# Altium schematic sheet MCU.SchDoc
size A3; SheetNumber: 2; SheetTotal: 13
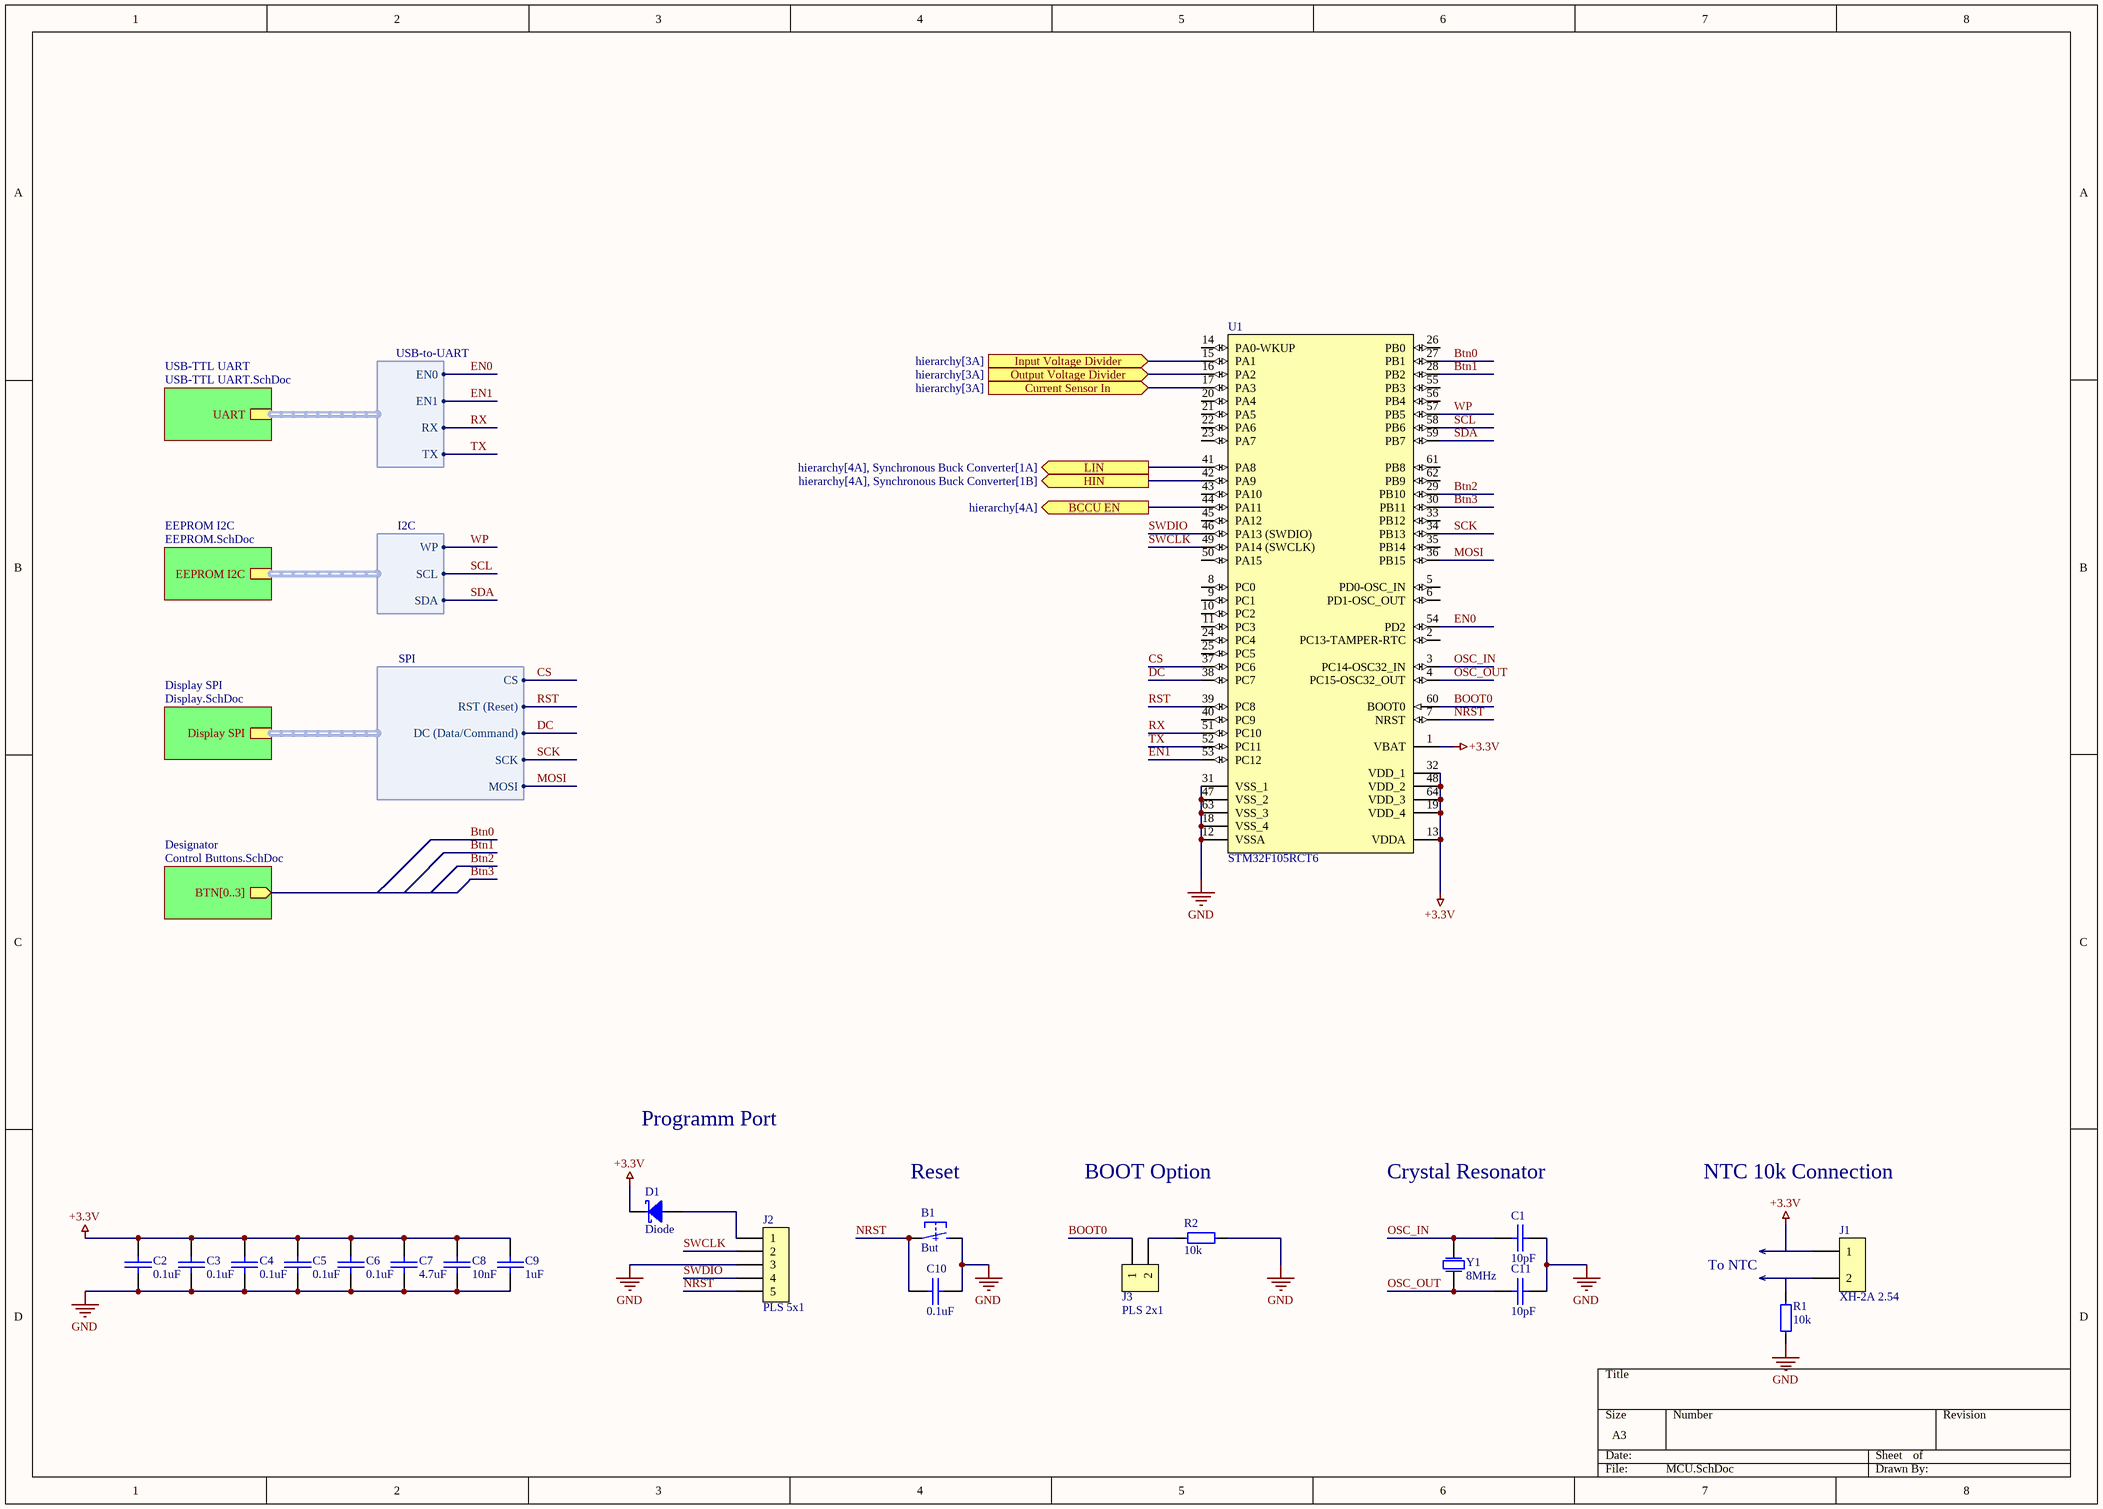
[diagram p0: MCU.SchDoc]

## Parts
B1  But  [BUTTON 6x3.5]
C1  10pF  [0805 Capicator]
C2  0.1uF  [0603 Capicator]
C3  0.1uF  [0603 Capicator]
C4  0.1uF  [0603 Capicator]
C5  0.1uF  [0603 Capicator]
C6  0.1uF  [0603 Capicator]
C7  4.7uF  [0603 Capicator]
C8  10nF  [0603 Capicator]
C9  1uF  [0603 Capicator]
C10  0.1uF  [0805 Capicator]
C11  10pF  [0805 Capicator]
D1  Diode  [sod-123]
J1  XH-2A 2.54  [CONN 1X2 (XH 2.54)]
J2  PLS 5x1  [PLS 5x1]
J3  PLS 2x1  [PLS 2X1]
R1  10k  [0805 Resistor]
R2  10k  [0805 Resistor]
U1  STM32F105RCT6  [LQFP64]
Y1  8MHz  [R38]

## Sub-sheets
Designator = Control Buttons.SchDoc: BTN[0..3] (out)
Display SPI = Display.SchDoc: Display SPI (harness SPI)
EEPROM I2C = EEPROM.SchDoc: EEPROM I2C (harness I2C)
USB-TTL UART = USB-TTL UART.SchDoc: UART (harness USB-to-UART)

## Ports
BCCU EN (out, see hierarchy[4A]), Current Sensor In (in, see hierarchy[3A]), HIN (out, see hierarchy[4A], Synchronous Buck Converter[1B]), Input Voltage Divider (in, see hierarchy[3A]), LIN (out, see hierarchy[4A], Synchronous Buck Converter[1A]), Output Voltage Divider (in, see hierarchy[3A])

## Harnesses
USB-to-UART: EN0, EN1, RX, TX
I2C: WP, SCL, SDA
SPI: CS, RST (Reset), DC (Data/Command), SCK, MOSI

## Nets
+3.3V: C2.2 C3.2 C4.2 C5.2 C6.2 C7.2 C8.2 C9.2 D1.2 J1.1 U1.1(VBAT) U1.13(VDDA) U1.19(VDD_4) U1.32(VDD_1) U1.48(VDD_2) U1.64(VDD_3)
GND: B1.2 C1.1 C2.1 C3.1 C4.1 C5.1 C6.1 C7.1 C8.1 C9.1 C10.2 C11.1 J2.3 R1.1 R2.2 U1.12(VSSA) U1.18(VSS_4) U1.31(VSS_1) U1.47(VSS_2) U1.63(VSS_3)
BCCU EN: U1.44(PA11) ; port BCCU EN
BOOT0: J3.1 U1.60(BOOT0)
Btn0: U1.27(PB1)
Btn1: U1.28(PB2)
Btn2: U1.29(PB10)
Btn3: U1.30(PB11)
CS: U1.37(PC6) ; sheet Display SPI/Display SPI.CS
Current Sensor In: U1.17(PA3) ; port Current Sensor In
DC: U1.38(PC7) ; sheet Display SPI/Display SPI.DC (Data/Command)
EN0: U1.54(PD2) ; sheet USB-TTL UART/UART.EN0
EN1: U1.53(PC12) ; sheet USB-TTL UART/UART.EN1
HIN: U1.42(PA9) ; port HIN
Input Voltage Divider: U1.15(PA1) ; port Input Voltage Divider
LIN: U1.41(PA8) ; port LIN
MOSI: U1.36(PB15) ; sheet Display SPI/Display SPI.MOSI
NRST: B1.1 C10.1 J2.5 U1.7(NRST)
OSC_IN: C1.2 U1.3(PC14-OSC32_IN) Y1.2
OSC_OUT: C11.2 U1.4(PC15-OSC32_OUT) Y1.1
Output Voltage Divider: U1.16(PA2) ; port Output Voltage Divider
RST: U1.39(PC8) ; sheet Display SPI/Display SPI.RST (Reset)
RX: U1.51(PC10) ; sheet USB-TTL UART/UART.RX
SCK: U1.34(PB13) ; sheet Display SPI/Display SPI.SCK
SCL: U1.58(PB6) ; sheet EEPROM I2C/EEPROM I2C.SCL
SDA: U1.59(PB7) ; sheet EEPROM I2C/EEPROM I2C.SDA
SWCLK: J2.2 U1.49(PA14_(SWCLK))
SWDIO: J2.4 U1.46(PA13_(SWDIO))
TX: U1.52(PC11) ; sheet USB-TTL UART/UART.TX
WP: U1.57(PB5) ; sheet EEPROM I2C/EEPROM I2C.WP
NetD1_1: D1.1 J2.1
NetJ1_2: J1.2 R1.2
NetJ3_2: J3.2 R2.1

Not connected (* = marked no-connect by the designer): U1 2(PC13-TAMPER-RTC) 5(PD0-OSC_IN) 6(PD1-OSC_OUT) 8(PC0) 9(PC1) 10(PC2) 11(PC3) 14(PA0-WKUP) 20(PA4) 21(PA5) 22(PA6) 23(PA7) 24(PC4) 25(PC5) 26(PB0) 33(PB12) 35(PB14) 40(PC9) 43(PA10) 45(PA12) 50(PA15) 55(PB3) 56(PB4) 61(PB8) 62(PB9)

## Notes on the sheet
- Programm Port
- Reset
- BOOT Option
- Crystal Resonator
- NTC 10k Connection
- (near R1) To NTC

## Library data of the parts
B1 = Button 2 Conn: Button 2 Conn SMD; Part Number: L-KLS7-TS3608-5.0-180; Manufacturer: KLS electronic co ltd; Type: Button; ComponentLink1Description: Chip&Dip; ComponentLink1URL: https://www.chipdip.ru/product/kls7-ts3608-5.0-180-td-02xa
C1 C11 = Cap 10pF (0805): 10pF NP0 50V 5% 0805; Manufacturer: Murata Manufacturing; Part Number: GRM2165C1H100JZ01D; Type: Capacitor; ComponentLink1Description: Chip&Dip; ComponentLink1URL: https://www.chipdip.ru/product/grm2165c1h100j
C2-C6 = Cap 0.1uF (0603): 0.1uF X7R 16V 10% 0603; Manufacturer: Murata Manufacturing; Part Number: GRM188R71C104KA01D; Type: Capacitor; ComponentLink1Description: Chip&Dip; ComponentLink1URL: https://www.chipdip.ru/product/grm188r71c104ka01d
C7 = Cap 4.7uF (0603): 4.7uF X5R 25V 10% 0603; Manufacturer: Murata Manufacturing; Part Number: GRM188R61E475KE11D; Type: Capacitor; ComponentLink1Description: Chip&Dip; ComponentLink1URL: https://www.chipdip.ru/product0/9000348448
C8 = Cap 10nF (0603): X7R 10nF 100V 10% 0603; Manufacturer: Murata Manufacturing; Part Number: GRM188R72A103KA01D; Type: Capacitor; ComponentLink1Description: Chip&Dip; ComponentLink1URL: https://www.chipdip.ru/product/grm188r72a103ka01d
C9 = Cap 1uF (0603): 1uF X5R 25V 10% 0603; Manufacturer: Murata Manufacturing; Part Number: GRM188R61E105KAADD; Type: Capacitor; ComponentLink1Description: Chip&Dip; ComponentLink1URL: https://www.chipdip.ru/product/grm188r61e105k
C10 = Cap 0.1uF (0805): 0.1uF X7R 25V 10% 0805; Manufacturer: Murata Manufacturing; Part Number: GRM21BR71E104KA01L; Type: Capacitor; ComponentLink1Description: Chip&Dip; ComponentLink1URL: https://www.chipdip.ru/product/grm21br71e104ka01l
D1 = Diode Schottky (SOD-123): 0.5 A, Low Forward Voltage less than 385 mV, 400 mW Power Dissipation Package; Part Number: MBR0520L; Manufacturer: ON Semiconductor; Type: Diode; ComponentLink1Description: DataSheet; ComponentLink1URL: http://www.farnell.com/datasheets/1875336.pdf; ComponentLink2Description: Chip&Dip; ComponentLink2URL: https://www.chipdip.ru/product/mbr0520l
J1 = Connector XH-2A 2.54: Connector on the board straight 2pin 2.54mm; Type: Connector; ComponentLink1Description: Buy; ComponentLink1URL: https://radioremont.com/product/razem-xh-2a-2-54mm-k148-3/
J2 = Conn 5 (PLS): Header, 5-Pin
J3 = Conn 2 (PLS)
R1 R2 = Res 10k (0805): 0.125W 0805 10k, 1%; Part Number: RC0805FR-0710KL; Manufacturer: Taiwan; Type: Resistor; ComponentLink1Description: Chip&Dip; ComponentLink1URL: https://www.chipdip.ru/product0/9000079514
U1 = STM32F105RCT6: MCU ARM 256KB FLASH MEM 64-LQFP; Manufacturer: STMicroelectronics; Part Number: STM32F105RCT6; ComponentLink1Description: DataSheet; ComponentLink1URL: https://static6.arrow.com/aropdfconversion/3fd6bc01359f79a4f9745354b823e6b7c79e203b/2083962039691295cd00220364.pdf; ComponentLink2Description: Chip&Dip; ComponentLink2URL: https://www.chipdip.ru/product0/8001787632; Type: IC
Y1 = Crystal 8MHz: Crystal. HC-49S (US); Manufacturer: China; Part Number: 8.000MHzHC-49US; Type: Crystal; ComponentLink1Description: Chip&Dip; ComponentLink1URL: https://www.chipdip.ru/product/8mhz-hc-49s